# EAGLE design ioboard (EAGLE 9.6.2)
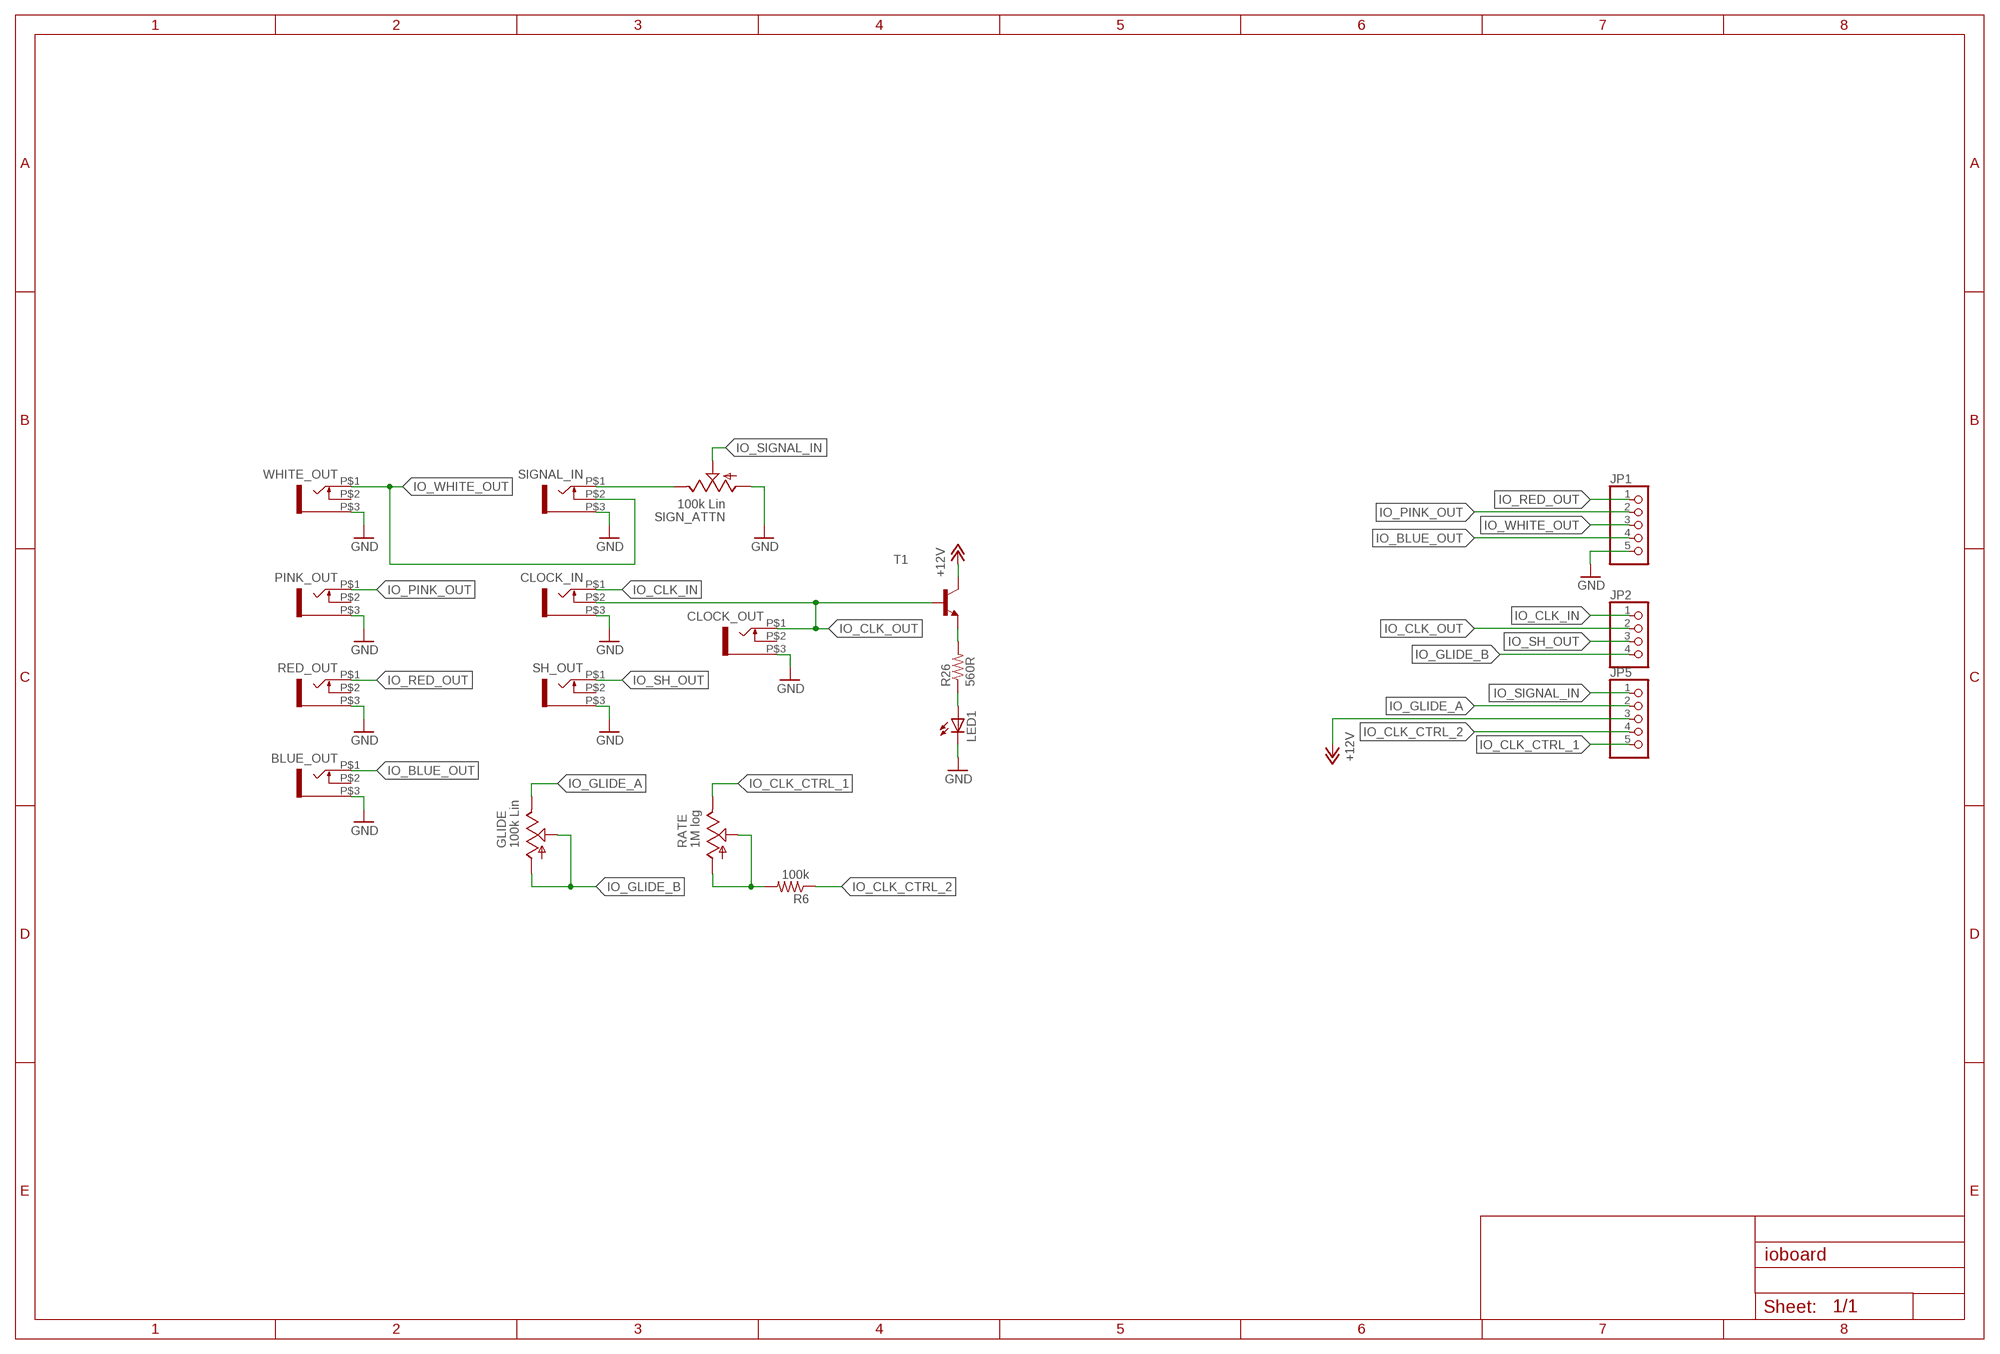
[diagram p0: schematic, sheet 1]

## Parts
BLUE_OUT  WQP-PJ301M-12_JACK  [WQP-PJ301M-12_JACK]
CLOCK_IN  WQP-PJ301M-12_JACK  [WQP-PJ301M-12_JACK]
CLOCK_OUT  WQP-PJ301M-12_JACK  [WQP-PJ301M-12_JACK]
GLIDE  100k Lin  ALPHA-9MMA  [EVUF]
JP1  PINHD-1X5  [1X05]
JP2  PINHD-1X4  [1X04]
JP5  PINHD-1X5  [1X05]
LED1  LED3MM  [LED3MM]
PINK_OUT  WQP-PJ301M-12_JACK  [WQP-PJ301M-12_JACK]
R6  100k  R-US_0204/7  [0204/7]
R26  560R  R-US_0204/7  [0204/7]
RATE  1M log  ALPHA-9MMA  [EVUF]
RED_OUT  WQP-PJ301M-12_JACK  [WQP-PJ301M-12_JACK]
SH_OUT  WQP-PJ301M-12_JACK  [WQP-PJ301M-12_JACK]
SIGN_ATTN  100k Lin  ALPHA-9MMA  [EVUF]
SIGNAL_IN  WQP-PJ301M-12_JACK  [WQP-PJ301M-12_JACK]
T1  BC550-NPN-TO92-CBE  [TO92-CBE]
WHITE_OUT  WQP-PJ301M-12_JACK  [WQP-PJ301M-12_JACK]

## Nets
+12V: JP5.3 T1.C
GND: BLUE_OUT.P$3 CLOCK_IN.P$3 CLOCK_OUT.P$3 JP1.5 LED1.K(C) PINK_OUT.P$3 RED_OUT.P$3 SH_OUT.P$3 SIGN_ATTN.1(A) SIGNAL_IN.P$3 WHITE_OUT.P$3
IO_BLUE_OUT: BLUE_OUT.P$1 JP1.4
IO_CLK_CTRL_1: JP5.5 RATE.3(E)
IO_CLK_CTRL_2: JP5.4 R6.1
IO_CLK_IN: CLOCK_IN.P$1 JP2.1
IO_CLK_OUT: CLOCK_IN.P$2 CLOCK_OUT.P$1 JP2.2 T1.B
IO_GLIDE_A: GLIDE.3(E) JP5.2
IO_GLIDE_B: GLIDE.1(A) GLIDE.2(S) JP2.4
IO_PINK_OUT: JP1.2 PINK_OUT.P$1
IO_RED_OUT: JP1.1 RED_OUT.P$1
IO_SH_OUT: JP2.3 SH_OUT.P$1
IO_SIGNAL_IN: JP5.1 SIGN_ATTN.2(S)
IO_WHITE_OUT: JP1.3 SIGNAL_IN.P$2 WHITE_OUT.P$1
N$8: SIGN_ATTN.3(E) SIGNAL_IN.P$1
N$14: LED1.A R26.1
N$15: R26.2 T1.E
N$27: R6.2 RATE.1(A) RATE.2(S)
Unconnected: BLUE_OUT.P$2 CLOCK_OUT.P$2 PINK_OUT.P$2 RED_OUT.P$2 SH_OUT.P$2 WHITE_OUT.P$2

## Library data of the parts
BLUE_OUT CLOCK_IN CLOCK_OUT PINK_OUT RED_OUT SH_OUT SIGNAL_IN WHITE_OUT = thonkiconn:WQP-PJ301M-12_JACK
GLIDE RATE SIGN_ATTN = TomW:ALPHA-9MM: 9 mm Square Rotary Potentiometers Source: Panasonic
JP1 JP5 = pinhead:PINHD-1X5: PIN HEADER
JP2 = pinhead:PINHD-1X4: PIN HEADER
LED1 = led:LED: LED OSRAM: - CHIPLED LG R971, LG N971, LY N971, LG Q971, LY Q971, LO R971, LY R971 LH N974, LH R974 LS Q976, LO Q976, LY Q976 LO Q996 - Hyper CHIPLED LW Q18S LB Q993, LB Q99A, LB R99A - SideLED LS A670, LO A670, LY A670, LG A670, LP A670 LB A673, LV A673, LT A673, LW A673 LH A674 LY A675 LS A676, LA A676, LO A676, LY A676, LW A676 LS A679, LY A679, LG A679 - Hyper Micro SIDELED® LS Y876, LA Y876, LO Y876, LY Y876 LT Y87S - SmartLED LW L88C, LW L88S LB L89C, LB L89S, LG L890 LS L89K, LO L89K, LY L89K LS L896, LA L896, LO L896, LY L896 - TOPLED LS T670, LO T670, LY T670, LG T670, LP T670 LSG T670, LSP T670, LSY T670, LOP T670, LYG T670 LG T671, LOG T671, LSG T671 LB T673, LV T673, LT T673, LW T673 LH T674 LS T676, LA T676, LO T676, LY T676, LB T676, LH T676, LSB T676, LW T676 LB T67C, LV T67C, LT T67C, LS T67K, LO T67K, LY T67K, LW E67C LS E67B, LA E67B, LO E67B, LY E67B, LB E67C, LV E67C, LT E67C LW T67C LS T679, LY T679, LG T679 LS T770, LO T770, LY T770, LG T770, LP T770 LB T773, LV T773, LT T773, LW T773 LH T774 LS E675, LA E675, LY E675, LS T675 LS T776, LA T776, LO T776, LY T776, LB T776 LHGB T686 LT T68C, LB T68C - Hyper Mini TOPLED® LB M676 - Mini TOPLED Santana® LG M470 LS M47K, LO M47K, LY M47K Source: http://www.osram.convergy.de LUXEON: - LUMILED® LXK2-PW12-R00, LXK2-PW12-S00, LXK2-PW14-U00, LXK2-PW14-V00 LXK2-PM12-R00, LXK2-PM12-S00, LXK2-PM14-U00 LXK2-PE12-Q00, LXK2-PE12-R00, LXK2-PE12-S00, LXK2-PE14-T00, LXK2-PE14-U00 LXK2-PB12-K00, LXK2-PB12-L00, LXK2-PB12-M00, LXK2-PB14-N00, LXK2-PB14-P00, LXK2-PB14-Q00 LXK2-PR12-L00, LXK2-PR12-M00, LXK2-PR14-Q00, LXK2-PR14-R00 LXK2-PD12-Q00, LXK2-PD12-R00, LXK2-PD12-S00 LXK2-PH12-R00, LXK2-PH12-S00 LXK2-PL12-P00, LXK2-PL12-Q00, LXK2-PL12-R00 Source: www.luxeon.com KINGBRIGHT: KA-3528ASYC Source: www.kingbright.com
R6 R26 = resistor:R-US_: RESISTOR, American symbol
T1 = transistor:*-NPN-: NPN Transistror BF959 corrected 2008.03.06

## Board
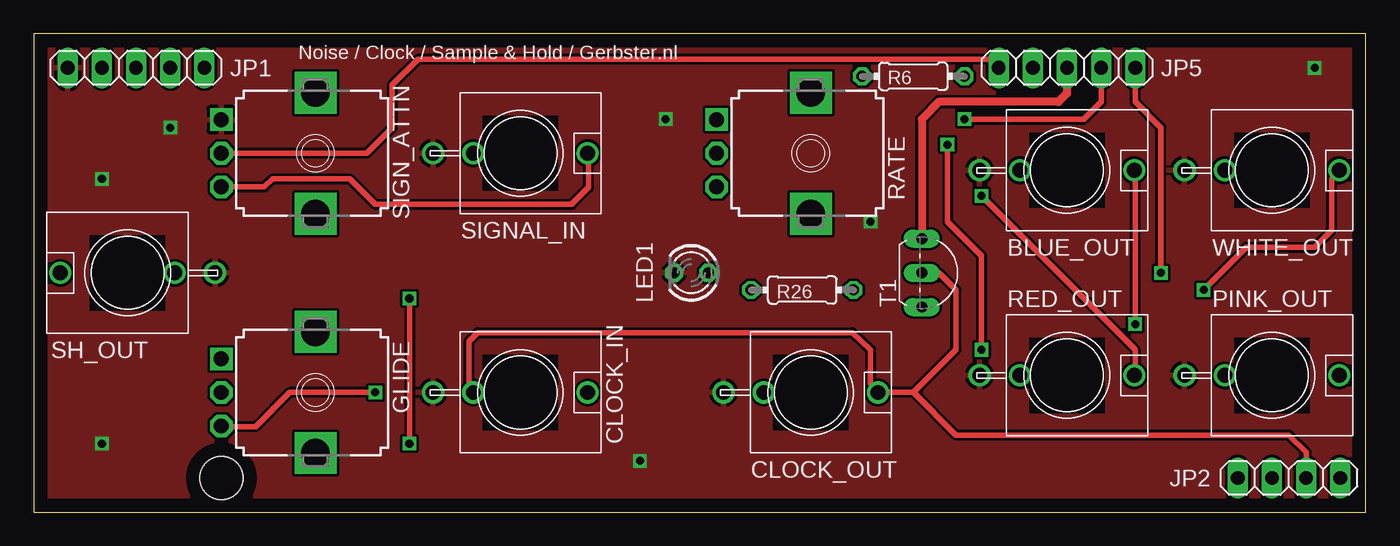
[diagram p1: board, top side]
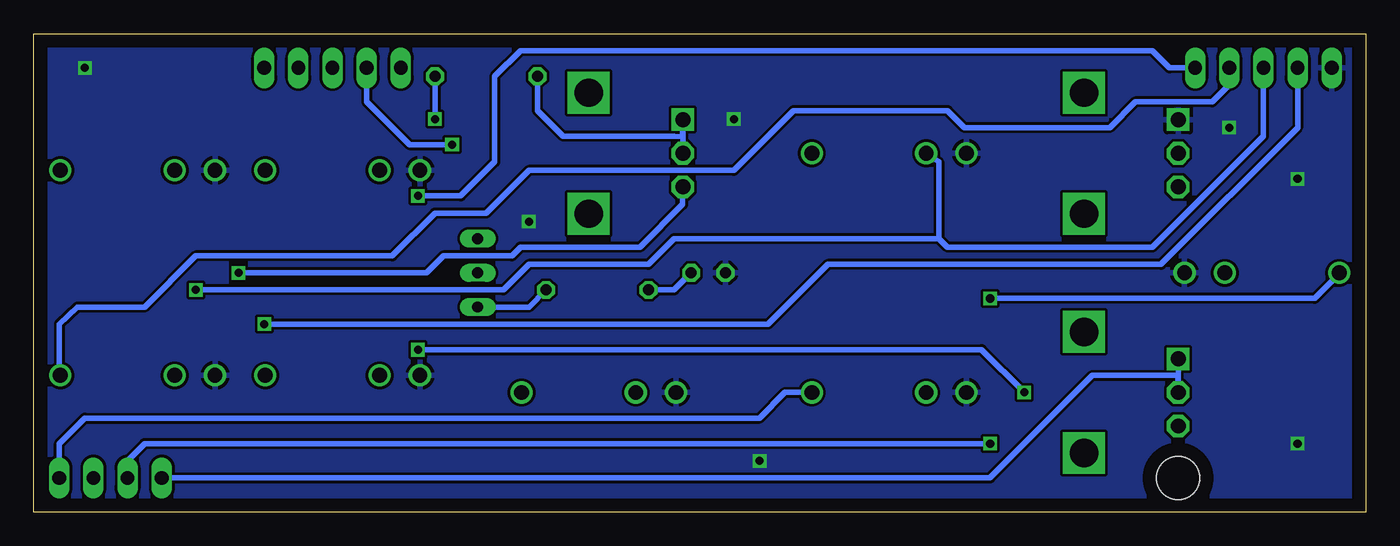
[diagram p2: board, bottom side, seen from below]

Size 99.06 x 35.56 mm. Coordinates in mm from the lower left corner, seen from the top.
Outline: 0,0 99.04,0 99.06,35.56 0,35.56 0,0
Copper layers (1*16): Top 0.035mm / dielectric 1.5mm / Bottom 0.035mm
Design rules "default": minimum track width 10mil, minimum drill 24mil, track to track 8mil, track to pad 8mil, pad to pad 8mil, via to via 8mil, smd to smd 8mil, copper to edge 40mil, drill to drill 8mil, minimum pad ring 10mil, minimum via ring 8mil, stop-mask expansion 4mil, vias tented up to drill 0mil, thermal gap 10mil
Holes 3.2 mm at 13.97,2.54

### Footprints (pad centres in the part's own frame; a part is rotated, then mirrored left to right if it is on the bottom)
WQP-PJ301M-12_JACK = drill 1.1: P$1 0,5; P$2 0,-3.5; P$3 0,-6.5
EVUF = drill 1.1 pad 1.676 square: 1 -2.5,-7 | drill 1.1 pad 1.676 octagon: 2 0,-7; 3 2.5,-7 | drill 2.1 pad 2.8 square: M1 4.5,0; M2 -4.5,0
1X05 = drill 1.016 long: 1 -5.08,0; 2 -2.54,0; 3 0,0; 4 2.54,0; 5 5.08,0
1X04 = drill 1.016 long: 1 -3.81,0; 2 -1.27,0; 3 1.27,0; 4 3.81,0
LED3MM = drill 0.813 octagon: A -1.27,0; K 1.27,0
0204/7 = drill 0.813 octagon: 1 -3.81,0; 2 3.81,0
TO92-CBE = drill 0.813 long: B 0,0; C -2.54,0; E 2.54,0

### Placement (x,y rotation side)
BLUE_OUT  76.83,25.4 270 top
CLOCK_IN  36.2,8.89 270 top
CLOCK_OUT  57.78,8.89 270 top
GLIDE  20.95,8.89 270 top
JP1  7.62,33.02 180 top
JP2  93.34,2.54 180 top
JP5  76.83,33.02 0 top
LED1  48.9,17.78 180 top
PINK_OUT  92.08,10.16 270 top
R6  65.41,32.38 180 top
R26  57.15,16.51 0 top
RATE  57.78,26.67 270 top
RED_OUT  76.83,10.16 270 top
SH_OUT  6.99,17.78 90 top
SIGN_ATTN  20.95,26.67 270 top
SIGNAL_IN  36.2,26.67 270 top
T1  66.04,17.78 270 top
WHITE_OUT  92.08,25.4 270 top

### Tracks (layer width: path | path; a pad name or v marks a point on that pad's centre or on a via)
+12V
  Top 0.61: JP5.3 76.83,31.11 76.2,30.48 67.31,30.48 66.04,29.21 T1.C
GND  (via drill 0.6)
  other vias: 5.08,5.08 5.08,24.77 45.09,3.81 95.25,33.02 46.99,29.21 10.16,28.57 62.23,21.59
  pour Bottom: 0,35.56 0,0 99.06,0 99.06,35.56
  pour Top: 0,35.56 0,0 99.06,0 99.06,35.56
IO_BLUE_OUT  (via drill 0.6)
  Top 0.406: v81.92,13.97 81.92,25.4 BLUE_OUT.P$1
  Bottom 0.406: JP1.4 5.08,28.57 15.24,18.41 40.01,18.41 44.45,13.97 v81.92,13.97
IO_CLK_CTRL_1  (via drill 0.6)
  Top 0.406: RATE.3 v50.8,24.13 | v83.82,17.78 83.82,28.57 81.92,30.48 JP5.5
  Bottom 0.406: v50.8,24.13 50.8,22.86 53.98,19.68 62.87,19.68 63.5,19.05 68.58,19.05 69.85,17.78 v83.82,17.78
IO_CLK_CTRL_2  (via drill 0.6)
  Top 0.406: v69.22,29.21 78.11,29.21 79.38,30.48 JP5.4
  Bottom 0.406: R6.1 v69.22,29.21
IO_CLK_IN
  Bottom 0.406: JP2.1 97.16,5.08 95.25,6.99 45.09,6.99 43.18,8.89 CLOCK_IN.P$1
IO_CLK_OUT
  Top 0.406: JP2.2 94.61,4.45 93.34,5.71 68.58,5.71 65.41,8.89 | 65.41,8.89 CLOCK_OUT.P$1 62.23,9.53 62.23,12.06 60.88,13.34 33.02,13.34 32.38,12.7 32.38,9.53 CLOCK_IN.P$2 | 65.41,8.89 68.58,12.06 68.58,16.51 67.31,17.78 T1.B
IO_GLIDE_A  (via drill 0.6)
  Top 0.406: v67.94,27.3 67.94,21.59 70.48,19.05 v70.48,12.06 | v25.4,8.89 19.05,8.89 16.51,6.35 14.59,6.35 GLIDE.3
  Bottom 0.406: JP5.2 74.3,30.48 71.12,27.3 v67.94,27.3 | v70.48,12.06 28.57,12.06 v25.4,8.89
IO_GLIDE_B
  Bottom 0.406: JP2.4 27.94,2.54 20.32,10.16 13.97,10.16 13.97,8.89 GLIDE.2 GLIDE.1
IO_PINK_OUT
  Bottom 0.406: JP1.2 10.16,31.75 11.43,30.48 17.14,30.48 19.05,28.57 29.84,28.57 31.11,29.84 42.55,29.84 46.99,25.4 62.23,25.4 65.41,22.23 69.22,22.23 72.39,19.05 87,19.05 90.81,15.24 95.81,15.24 97.16,13.97 97.16,10.16 PINK_OUT.P$1
IO_RED_OUT  (via drill 0.6)
  Top 0.406: v70.48,23.5 81.92,12.06 81.92,10.16 arc-7 RED_OUT.P$1
  Bottom 0.406: JP1.1 14.61,33.02 15.88,34.29 62.87,34.29 64.77,32.38 64.77,26.04 67.31,23.5 v70.48,23.5
IO_SH_OUT  (via drill 0.6)
  Top 0.406: v27.94,15.88 v27.94,5.08
  Bottom 0.406: SH_OUT.P$1 1.91,17.78 3.81,15.88 v27.94,15.88 | v27.94,5.08 90.81,5.08 92.08,3.81 JP2.3
IO_SIGNAL_IN
  Top 0.406: JP5.1 71.12,33.66 28.57,33.66 26.67,31.75 26.67,28.57 24.77,26.67 SIGN_ATTN.2
IO_WHITE_OUT  (via drill 0.6)
  Top 0.406: v87,16.51 90.17,19.68 95.25,19.68 96.52,20.95 96.52,24.77 WHITE_OUT.P$1
  Bottom 0.406: JP1.3 7.62,27.94 15.88,19.68 31.11,19.68 31.75,20.32 | SIGNAL_IN.P$2 31.75,26.04 31.75,20.32 | 31.75,20.32 51.44,20.32 53.34,18.41 62.23,18.41 64.14,16.51 v87,16.51
N$8
  Top 0.406: SIGN_ATTN.3 17.14,24.17 17.78,24.77 23.5,24.77 25.4,22.86 40.01,22.86 41.27,24.13 41.27,26.67 SIGNAL_IN.P$1
N$14
  Bottom 0.406: R26.1 51.44,16.51 LED1.A
N$15
  Bottom 0.406: R26.2 62.23,15.24 T1.E
N$27
  Bottom 0.406: RATE.2 RATE.1 50.8,27.9 51.44,27.94 59.69,27.94 61.59,29.84 R6.2

### Text on the board
tNames: Noise / Clock / Sample & Hold / Gerbster.nl